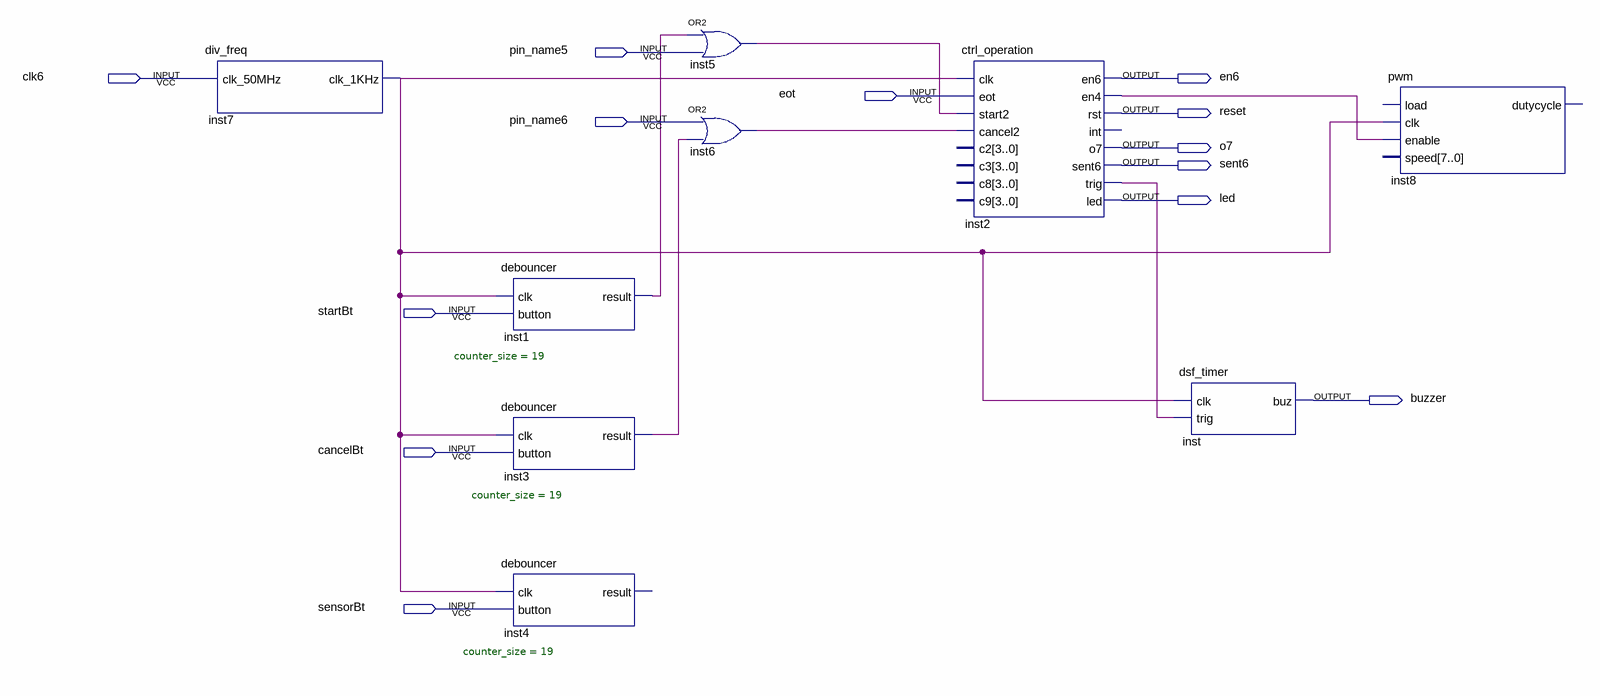
[diagram p0: schematic sheet]
// Quartus schematic operation.bdf as structural Verilog: 9 symbols, 13 pins
module operation (
  input  pin_name5,
  input  clk6,
  input  eot,
  input  pin_name6,
  input  startBt,
  input  cancelBt,
  input  sensorBt,
  output en6,
  output reset,
  output o7,
  output sent6,
  output led,
  output buzzer
);

  wire inst1_result, inst2_en4, inst2_trig, inst3_result, inst5_out, inst6_out, inst7_clk_1khz;

  div_freq inst7 (.clk_50MHz(clk6), .clk_1KHz(inst7_clk_1khz));
  debouncer #(.counter_size(19)) inst1 (.clk(inst7_clk_1khz), .button(startBt), .result(inst1_result));
  debouncer #(.counter_size(19)) inst3 (.clk(inst7_clk_1khz), .button(cancelBt), .result(inst3_result));
  debouncer #(.counter_size(19)) inst4 (.clk(inst7_clk_1khz), .button(sensorBt));  // open: result
  or inst5 (inst5_out, inst1_result, pin_name5);
  or inst6 (inst6_out, pin_name6, inst3_result);
  ctrl_operation inst2 (
    .clk(inst7_clk_1khz), .eot(eot), .start2(inst5_out), .cancel2(inst6_out), .en6(en6), .en4(inst2_en4),
    .rst(reset), .o7(o7), .sent6(sent6), .trig(inst2_trig), .led(led));  // open: c2, c3, c8, c9, int
  dsf_timer inst (.clk(inst7_clk_1khz), .trig(inst2_trig), .buz(buzzer));
  pwm inst8 (.clk(inst7_clk_1khz), .enable(inst2_en4));  // open: load, speed, dutycycle
endmodule
